# EAGLE design amp_tda2030a_v_1_0 (EAGLE 6.4)
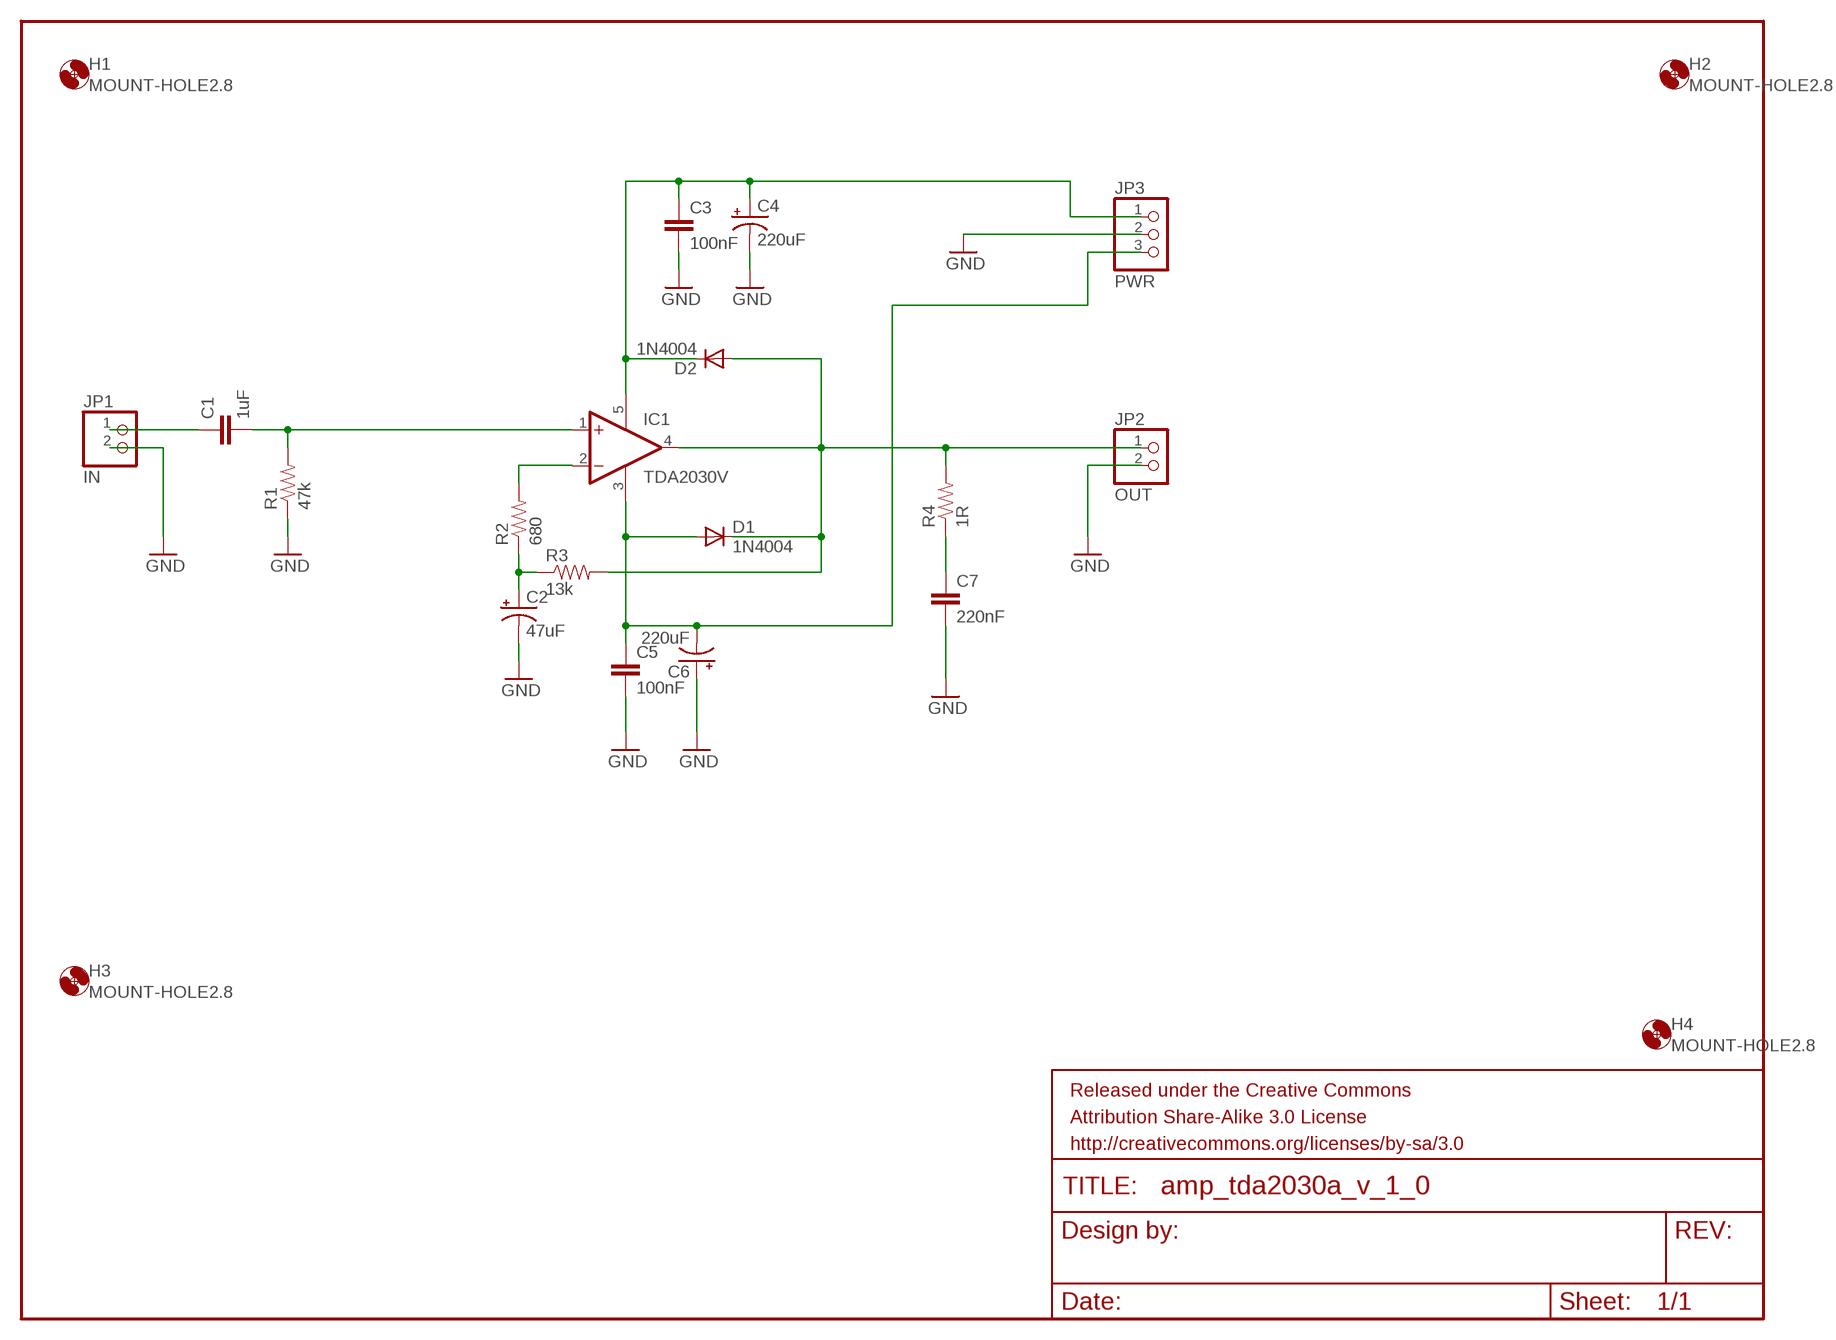
[diagram p0: schematic, sheet 1]

## Parts
C1  1uF  CAPPTH3  [CAP-PTH-LARGE]
C2  47uF  CAP_POLPTH1  [CPOL-RADIAL-100UF-25V]
C3  100nF  CAPPTH1  [CAP-PTH-5MM]
C4  220uF  CAP_POLPTH1  [CPOL-RADIAL-100UF-25V]
C5  100nF  CAPPTH1  [CAP-PTH-5MM]
C6  220uF  CAP_POLPTH1  [CPOL-RADIAL-100UF-25V]
C7  220nF  CAPPTH3  [CAP-PTH-LARGE]
D1  1N4004  [DO41-10]
D2  1N4004  [DO41-10]
FRAME1  FRAME-LETTER  [CREATIVE_COMMONS]
H1  MOUNT-HOLE2.8  [2,8]
H2  MOUNT-HOLE2.8  [2,8]
H3  MOUNT-HOLE2.8  [2,8]
H4  MOUNT-HOLE2.8  [2,8]
IC1  TDA2030V  [CB360]
JP1  IN  PINHD-1X2  [1X02]
JP2  OUT  PINHD-1X2  [1X02]
JP3  PWR  PINHD-1X3  [1X03]
R1  47k  RESISTORPTH-1/4W  [AXIAL-0.4]
R2  680  RESISTORPTH-1/4W  [AXIAL-0.4]
R3  13k  RESISTORPTH-1/4W  [AXIAL-0.4]
R4  1R  RESISTORPTH-1/4W  [AXIAL-0.4]

## Nets
GND: C2.2(-) C3.2 C4.2(-) C5.2 C6.1(+) C7.2 JP1.2 JP2.2 JP3.2 R1.P$1
N$1: C1.1 JP1.1
N$2: C1.2 IC1.1(+IN) R1.P$2
N$3: IC1.2(-IN) R2.P$2
N$4: C2.1(+) R2.P$1 R3.P$1
N$5: C5.1 C6.2(-) D1.A IC1.3(GND) JP3.3
N$6: D1.C D2.A IC1.4(OUT) JP2.1 R3.P$2 R4.P$2
N$7: C7.1 R4.P$1
N$8: C3.1 C4.1(+) D2.C IC1.5(V+) JP3.1

## Library data of the parts
C1 C3 C5 = SparkFun-Capacitors:CAP: Capacitor Standard 0603 ceramic capacitor, and 0.1" leaded capacitor.
C2 C4 C6 = SparkFun-Capacitors:CAP_POL: Capacitor Polarized These are standard SMD and PTH capacitors. Normally 10uF, 47uF, and 100uF in electrolytic and tantalum varieties. Always verify the external diameter of the through hole cap, it varies with capacity, voltage, and manufacturer. The EIA devices should be standard.
C7 = SparkFun-Passives:CAP: Capacitor Standard 0603 ceramic capacitor, and 0.1" leaded capacitor.
D1 D2 = adafruit:1N4004: DIODE General purpose 1N400x type rectifier (With bigger pads) http://www.ladyada.net/library/pcb/eaglelibrary.html
FRAME1 = SparkFun-Aesthetics:FRAME-LETTER: Schematic Frame Standard 8.5x11 US Letter frame
H1-H4 = holes:MOUNT-HOLE: MOUNTING HOLE with drill center marker
IC1 = linear:TDA2030: Power OP AMP
JP1 JP2 = pinhead:PINHD-1X2: PIN HEADER
JP3 = pinhead:PINHD-1X3: PIN HEADER
R1-R4 = SparkFun-Passives:RESISTOR: Resistor Basic schematic elements and footprints for 0603, 1206, and PTH resistors.

## Board
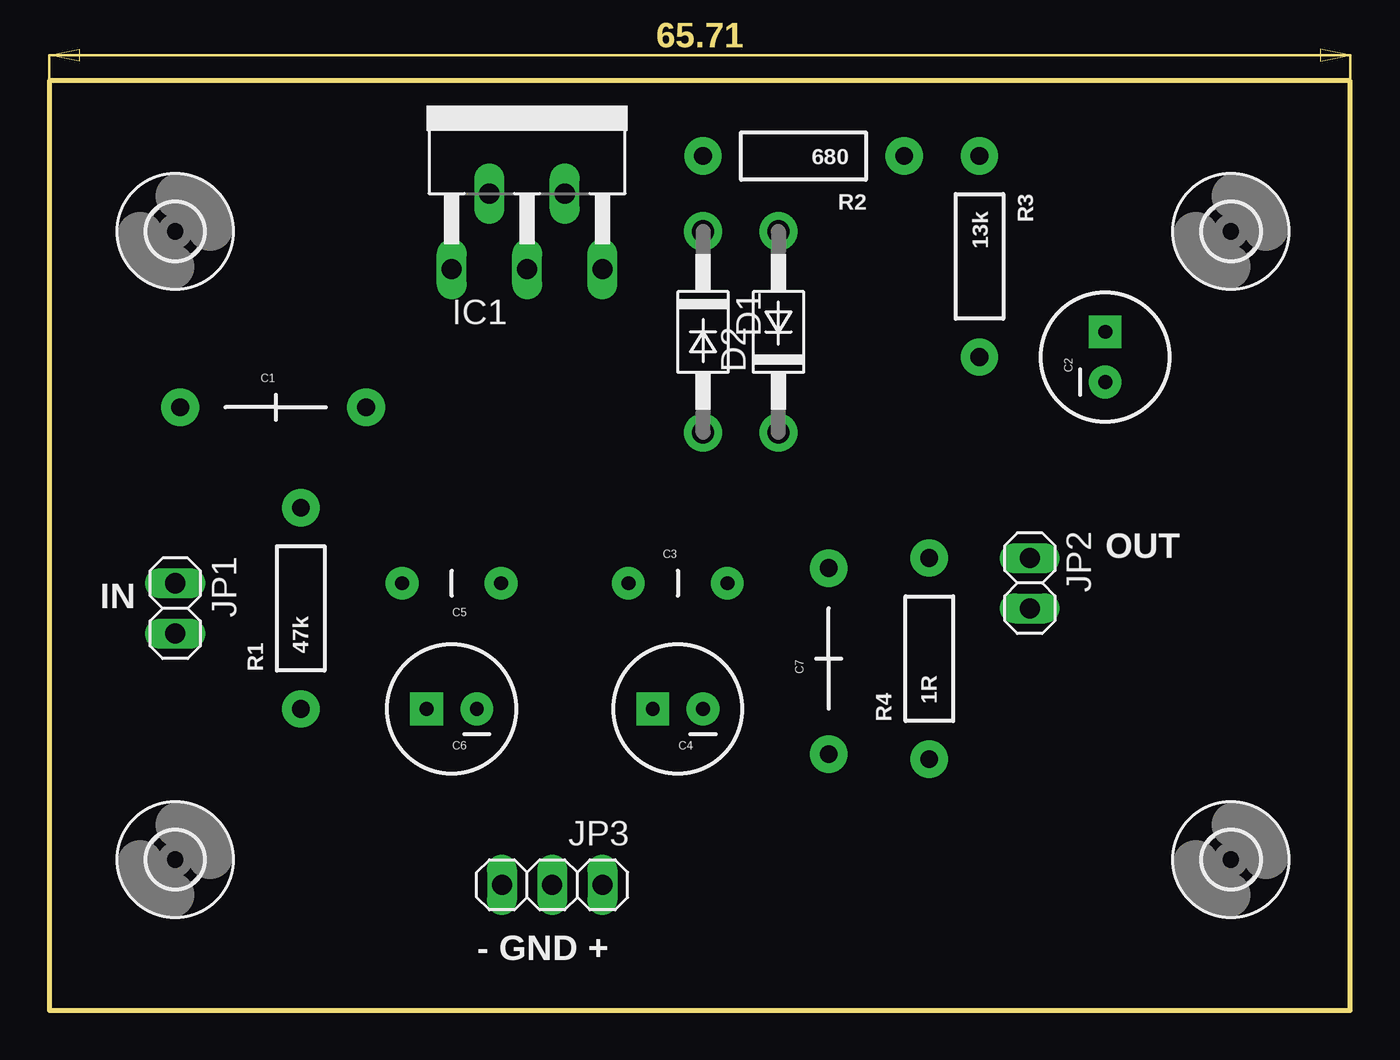
[diagram p1: board, top side]
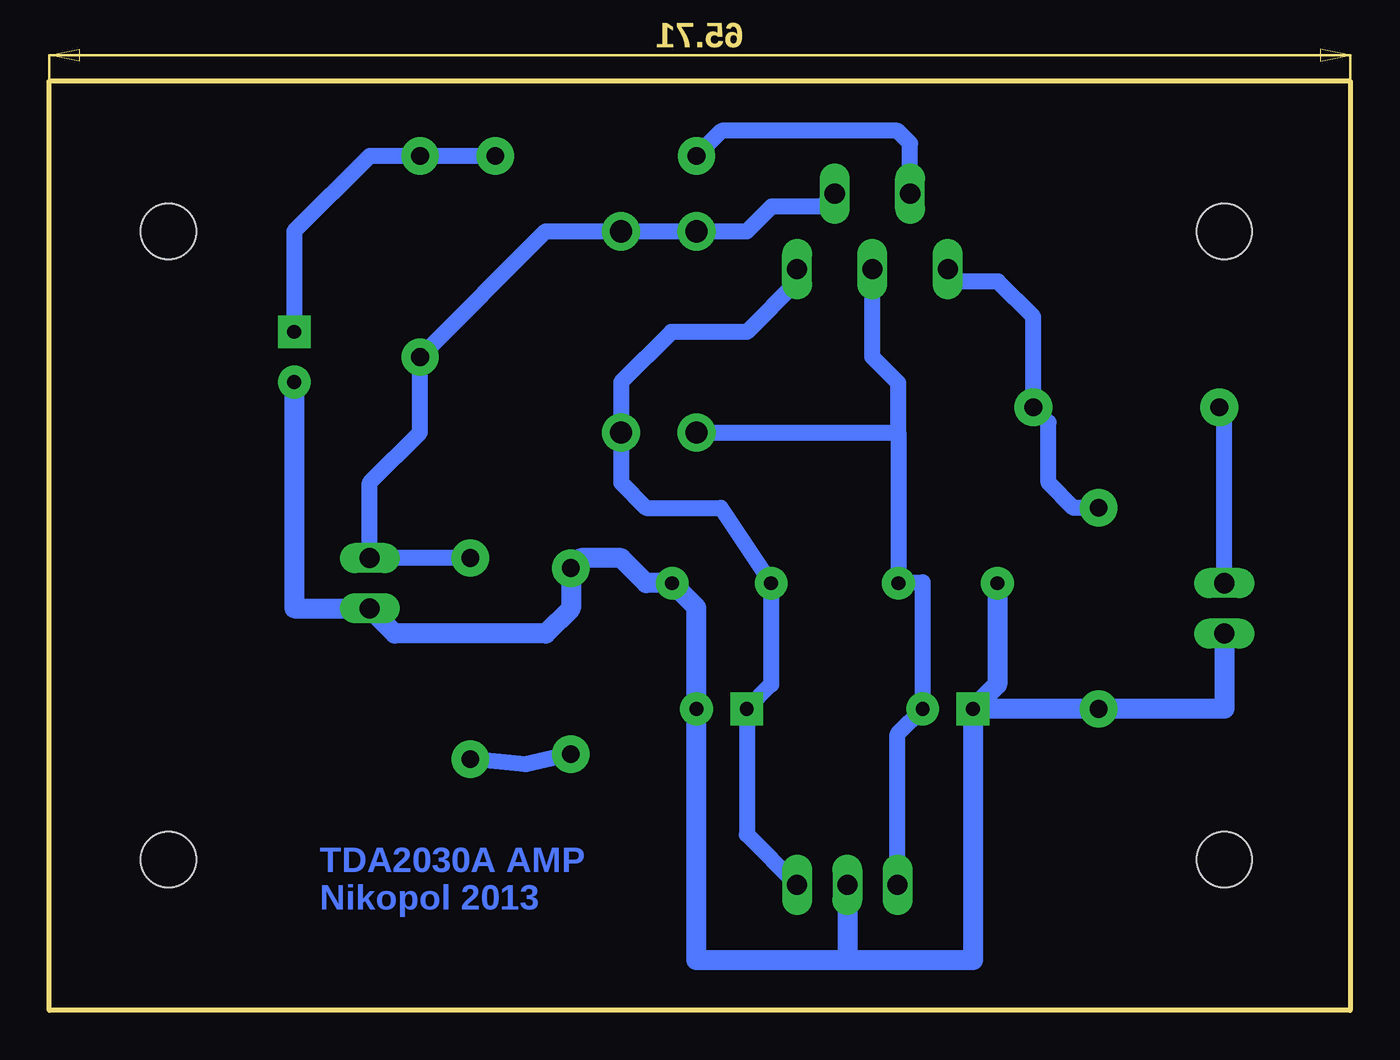
[diagram p2: board, bottom side, seen from below]

Size 65.71 x 46.98 mm. Coordinates in mm from the lower left corner, seen from the top.
Outline: 0,0 65.71,0 65.71,46.98 0,46.98 0,0
Copper layers (1*16): Top 0.035mm / dielectric 1.5mm / Bottom 0.035mm
Design rules "default": minimum track width 10mil, minimum drill 24mil, track to track 8mil, track to pad 8mil, pad to pad 8mil, via to via 8mil, smd to smd 8mil, copper to edge 40mil, drill to drill 8mil, minimum pad ring 10mil, minimum via ring 8mil, stop-mask expansion 4mil, vias tented up to drill 0mil, thermal gap 10mil

### Footprints (pad centres in the part's own frame; a part is rotated, then mirrored left to right if it is on the bottom)
CAP-PTH-LARGE = drill 0.9 pad 1.905: 1 -4.826,0; 2 4.572,0
CPOL-RADIAL-100UF-25V = drill 0.7 pad 1.651 square: 1 1.27,0 | drill 0.7 pad 1.651: 2 -1.27,0
CAP-PTH-5MM = drill 0.7 pad 1.651: 1 -2.5,0; 2 2.5,0
DO41-10 = drill 1.118 pad 1.93: A 5.08,0; C -5.08,0
2,8 = hole 2.8: 0,0
CB360 = drill 1.016 long: 1 -3.81,-8.255; 2 -1.905,-4.445; 3 0,-8.255; 4 1.905,-4.445; 5 3.81,-8.255
1X02 = drill 1.016 long: 1 -1.27,0; 2 1.27,0
1X03 = drill 1.016 long: 1 -2.54,0; 2 0,0; 3 2.54,0
AXIAL-0.4 = drill 0.9 pad 1.88: P$1 -5.08,0; P$2 5.08,0

### Placement (x,y rotation side)
C1  11.43,30.48 0 top
C2  53.34,33.02 90 top
C3  31.75,21.59 0 top
C4  31.75,15.24 180 top
C5  20.32,21.59 180 top
C6  20.32,15.24 180 top
C7  39.37,17.78 90 top
D1  33.02,34.29 270 top
D2  36.83,34.29 90 top
FRAME1  1.27,50.8 0 top  (outside the outline)
H1  59.69,7.62 0 top
H2  6.35,7.62 0 top
H3  59.69,39.37 0 top
H4  6.35,39.37 180 top
IC1  24.13,45.72 0 top
JP1  6.35,20.32 270 top
JP2  49.53,21.59 270 top
JP3  25.4,6.35 180 top
R1  12.7,20.32 90 top
R2  38.1,43.18 180 top
R3  46.99,38.1 270 top
R4  44.45,17.78 90 top

### Tracks (layer width: path | path; a pad name or v marks a point on that pad's centre or on a via)
GND
  Bottom 1.016: JP1.2 6.35,15.24 R1.P$1 C6.1 | C5.2 17.82,16.47 C6.1 | C6.1 19.05,2.54 25.4,2.54 | JP3.2 25.4,2.54 | 25.4,2.54 33.02,2.54 C4.2 33.02,20.36 C3.2 35.56,21.59 36.83,22.86 38.86,22.86 C7.2 39.37,20.32 40.64,19.05 48.26,19.05 JP2.2 53.34,20.32 C2.2
N$1
  Bottom 0.813: JP1.1 6.35,30.23 C1.1
N$2
  Bottom 0.813: R1.P$2 13.97,25.4 15.24,26.67 15.24,29.72 C1.2 16,35.05 17.78,36.83 19.68,36.83 IC1.1
N$3
  Bottom 0.813: IC1.2 22.23,43.81 22.86,44.45 31.75,44.45 R2.P$2
N$4
  Bottom 0.813: R2.P$1 R3.P$1 49.53,43.18 53.34,39.37 C2.1
N$5
  Bottom 0.813: JP3.3 22.86,13.97 C6.2 21.59,21.63 C5.1 22.82,29.21 | 22.82,29.21 22.82,31.71 24.13,33.02 IC1.3 | D1.A 22.82,29.21
N$6
  Bottom 0.813: R4.P$2 JP2.1 49.53,26.67 46.99,29.21 R3.P$2 40.64,39.37 D2.A D1.C 30.48,39.37 29.21,40.64 26.67,40.64 IC1.4
N$7
  Bottom 0.813: C7.1 41.66,12.45 R4.P$1
N$8
  Bottom 0.813: IC1.5 27.94,36.83 30.48,34.29 34.29,34.29 36.83,31.75 D2.C 36.83,26.67 35.56,25.4 31.79,25.4 C3.1 29.25,16.47 C4.1 30.48,8.89 JP3.1

### Text on the board
Bottom: TDA2030A AMP / Nikopol 2013
tNames: OUT | IN | - GND +